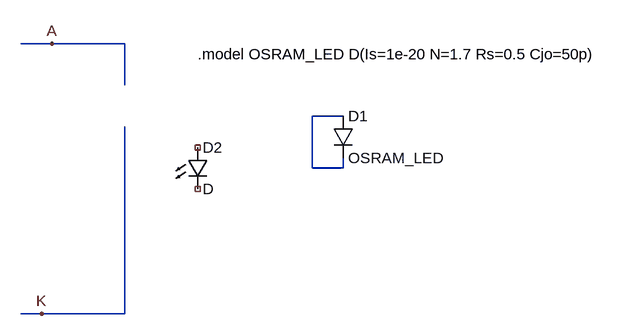
[diagram p0: schematic OSRAM_LED.asc]
OSRAM_LED.asc, the LTspice schematic file:
Version 4.1
SHEET 1 904 680
WIRE 16 -16 -32 -16
WIRE 128 -16 16 -16
WIRE 128 48 128 -16
WIRE 464 96 416 96
WIRE 416 176 416 96
WIRE 464 176 464 160
WIRE 464 176 416 176
WIRE 0 400 -32 400
WIRE 128 400 128 112
WIRE 128 400 0 400
FLAG 16 -16 A
FLAG 0 400 K
SYMBOL diode 448 96 R0
SYMATTR InstName D1
SYMATTR Value OSRAM_LED
SYMBOL LED 224 144 R0
SYMATTR InstName D2
TEXT 240 0 Left 2 !.model OSRAM_LED D(Is=1e-20 N=1.7 Rs=0.5 Cjo=50p)

The netlist it stands for:
* OSRAM_LED.asc
D1 N001 N001 OSRAM_LED
D2 NC_01 NC_02 D
.model D D
.lib standard.dio
.model OSRAM_LED D(Is=1e-20 N=1.7 Rs=0.5 Cjo=50p)
.backanno
.end